# Altium schematic sheet mixer.SchDoc
size A4
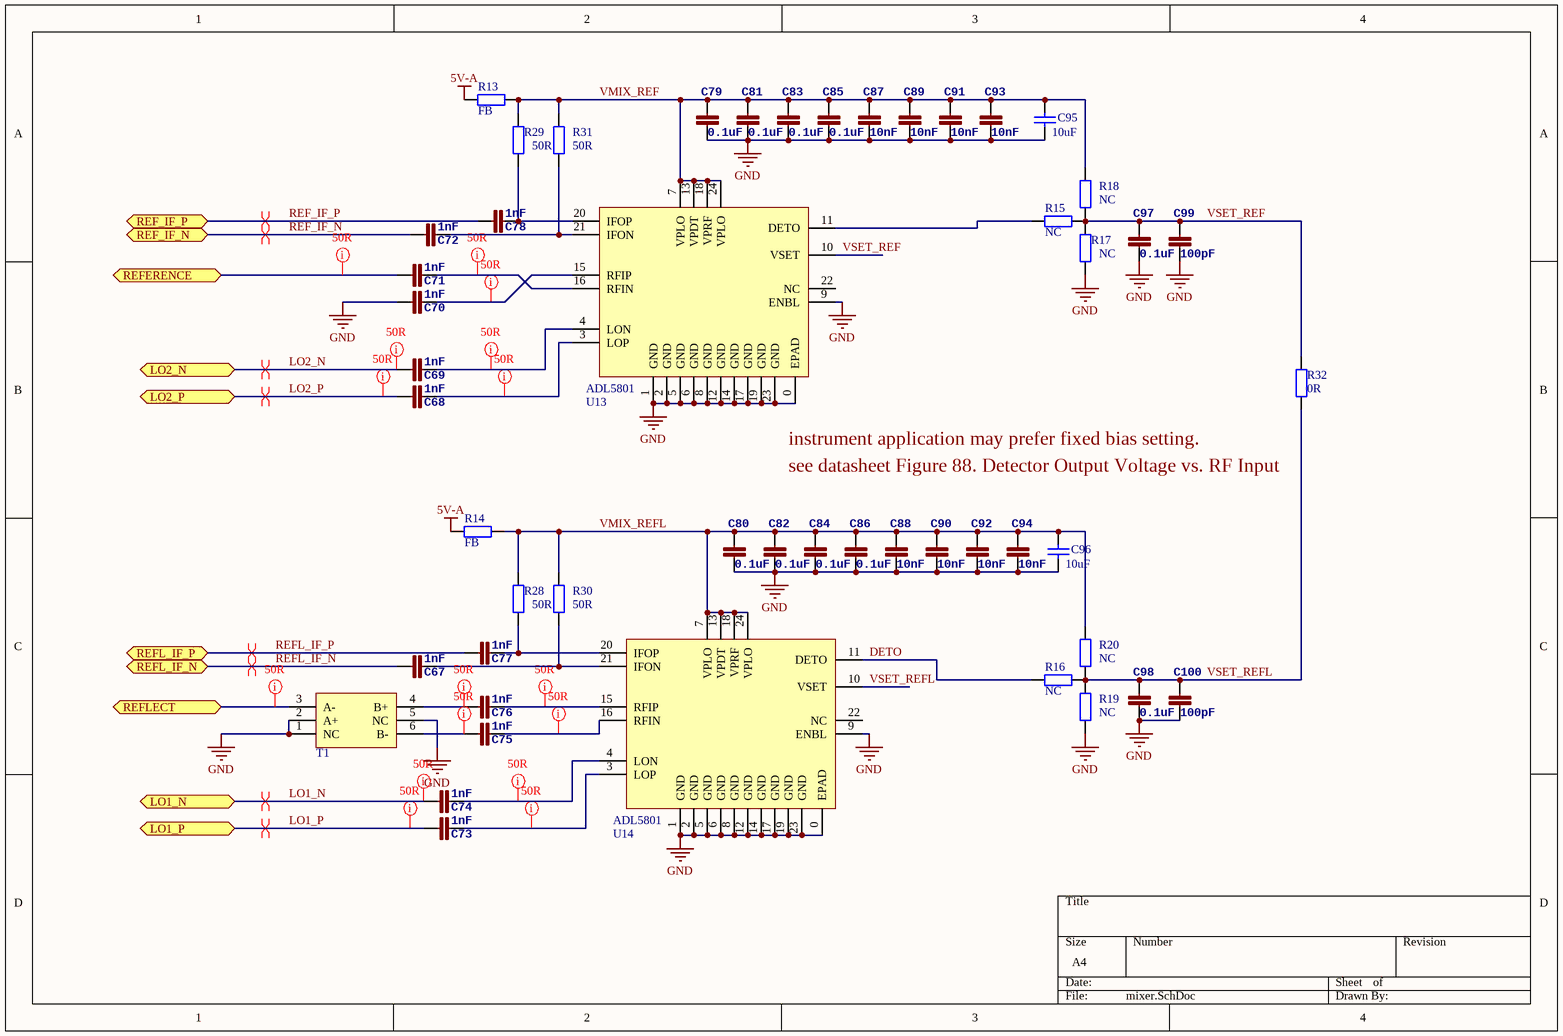
[diagram p0: mixer.SchDoc]

## Parts
C67  1nF  [0402]
C68  1nF  [0402]
C69  1nF  [0402]
C70  1nF  [0402]
C71  1nF  [0402]
C72  1nF  [0402]
C73  1nF  [0402]
C74  1nF  [0402]
C75  1nF  [0402]
C76  1nF  [0402]
C77  1nF  [0402]
C78  1nF  [0402]
C79  0.1uF  [0402]
C80  0.1uF  [0402]
C81  0.1uF  [0402]
C82  0.1uF  [0402]
C83  0.1uF  [0402]
C84  0.1uF  [0402]
C85  0.1uF  [0402]
C86  0.1uF  [0402]
C87  10nF  [0402]
C88  10nF  [0402]
C89  10nF  [0402]
C90  10nF  [0402]
C91  10nF  [0402]
C92  10nF  [0402]
C93  10nF  [0402]
C94  10nF  [0402]
C95  10uF  [0805]
C96  10uF  [0805]
C97  0.1uF  [0402]
C98  0.1uF  [0402]
C99  100pF  [0402]
C100  100pF  [0402]
R13  FB  [0603]
R14  FB  [0603]
R15  NC  [0402]
R16  NC  [0402]
R17  NC  [0402]
R18  NC  [0402]
R19  NC  [0402]
R20  NC  [0402]
R28  50R  [0402]
R29  50R  [0402]
R30  50R  [0402]
R31  50R  [0402]
R32  0R  [0402]
T1  TCM1-63AX+  [TCM1-63AX+]  (value not drawn)
U13  ADL5801  [ADL5801]
U14  ADL5801  [ADL5801]

## Ports
LO1_N, LO1_P, LO2_N, LO2_P, REF_IF_N, REF_IF_P, REFERENCE, REFL_IF_N, REFL_IF_P, REFLECT

## Nets
5V-A: R13.1 R14.1
GND: C70.1 C79.1 C80.1 C81.1 C82.1 C83.1 C84.1 C85.1 C86.1 C87.1 C88.1 C89.1 C90.1 C91.1 C92.1 C93.1 C94.1 C95.1 C96.1 C97.1 C98.1 C99.1 C100.1 R17.1 R19.1 T1.1(NC) T1.2(A+) T1.5(NC) U13.0(EPAD) U13.1(GND) U13.2(GND) U13.5(GND) U13.6(GND) U13.8(GND) U13.9(ENBL) U13.12(GND) U13.14(GND) U13.17(GND) U13.19(GND) U13.23(GND) U14.0(EPAD) U14.1(GND) U14.2(GND) U14.5(GND) U14.6(GND) U14.8(GND) U14.9(ENBL) U14.12(GND) U14.14(GND) U14.17(GND) U14.19(GND) U14.23(GND)
DETO: R16.2 U14.11(DETO)
LO1_N: C74.1 ; port LO1_N
LO1_P: C73.1 ; port LO1_P
LO2_N: C69.1 ; port LO2_N
LO2_P: C68.1 ; port LO2_P
REF_IF_N: C72.1 ; port REF_IF_N
REF_IF_P: C78.1 ; port REF_IF_P
REFERENCE: C71.1 ; port REFERENCE
REFL_IF_N: C67.1 ; port REFL_IF_N
REFL_IF_P: C77.1 ; port REFL_IF_P
REFLECT: T1.3(A-) ; port REFLECT
VMIX_REF: C79.2 C81.2 C83.2 C85.2 C87.2 C89.2 C91.2 C93.2 C95.2 R13.2 R18.2 R29.2 R31.2 U13.7(VPLO) U13.13(VPDT) U13.18(VPRF) U13.24(VPLO)
VMIX_REFL: C80.2 C82.2 C84.2 C86.2 C88.2 C90.2 C92.2 C94.2 C96.2 R14.2 R20.2 R28.2 R30.2 U14.7(VPLO) U14.13(VPDT) U14.18(VPRF) U14.24(VPLO)
VSET_REF: C97.2 C99.2 R15.1 R17.2 R18.1 R32.1 U13.10(VSET)
VSET_REFL: C98.2 C100.2 R16.1 R19.2 R20.1 R32.2 U14.10(VSET)
NetC67_2: C67.2 R30.1 U14.21(IFON)
NetC68_2: C68.2 U13.3(LOP)
NetC69_2: C69.2 U13.4(LON)
NetC70_2: C70.2 U13.15(RFIP)
NetC71_2: C71.2 U13.16(RFIN)
NetC72_2: C72.2 R31.1 U13.21(IFON)
NetC73_2: C73.2 U14.3(LOP)
NetC74_2: C74.2 U14.4(LON)
NetC75_1: C75.1 T1.6(B-)
NetC75_2: C75.2 U14.16(RFIN)
NetC76_1: C76.1 T1.4(B+)
NetC76_2: C76.2 U14.15(RFIP)
NetC77_2: C77.2 R28.1 U14.20(IFOP)
NetC78_2: C78.2 R29.1 U13.20(IFOP)
NetR15_2: R15.2 U13.11(DETO)

Not connected (* = marked no-connect by the designer): U13 22(NC); U14 22(NC)

## Layout directives
differential pair: LO1_N, LO1_P, LO2_N, LO2_P, REF_IF_N, REF_IF_P, REFL_IF_N, REFL_IF_P
net class 50R: LO1_N, LO1_P, LO2_N, LO2_P, NetC68_2, NetC69_2, NetC70_2, NetC71_2, NetC73_2, NetC74_2, NetC75_1, NetC75_2, NetC76_1, NetC76_2, REFERENCE, REFLECT

## Notes on the sheet
- instrument application may prefer fixed bias setting.
- see datasheet Figure 88. Detector Output Voltage vs. RF Input

## Library data of the parts
C67-C94 C97-C100 = CAP0402-CAP: <b>Capacitor</b> / Standard 0603 ceramic capacitor, and 0.1" leaded capacitor.; PARTNO: CC0402ZRY5V7BB104
C95 C96 = Cap: Capacitor; Published: 8-Jun-2000; LatestRevisionDate: 17-Jul-2002; LatestRevisionNote: Re-released for DXP Platform.; PackageReference: RAD-0.3; Publisher: Altium Limited; PackageDescription: Radial Cap, Thru-Hole; 2 Leads; 0.3 in Pin Spacing
R13 R14 = Res2: Resistor; Value: 0Ohm; Published: 8-Jun-2000; LatestRevisionDate: 17-Jul-2002; LatestRevisionNote: Re-released for DXP Platform.; PackageReference: AXIAL-0.4; Publisher: Altium Limited; PackageDescription: Axial Device, Thru-Hole; 2 Leads; 0.4 in Pin Spacing
R15-R20 R28-R32 = Res2: Resistor; Published: 8-Jun-2000; LatestRevisionDate: 17-Jul-2002; LatestRevisionNote: Re-released for DXP Platform.; PackageReference: AXIAL-0.4; Publisher: Altium Limited; PackageDescription: Axial Device, Thru-Hole; 2 Leads; 0.4 in Pin Spacing